# Altium schematic sheet ADC_CH_B.SchDoc
size A4; SheetNumber: 11; SheetTotal: 11
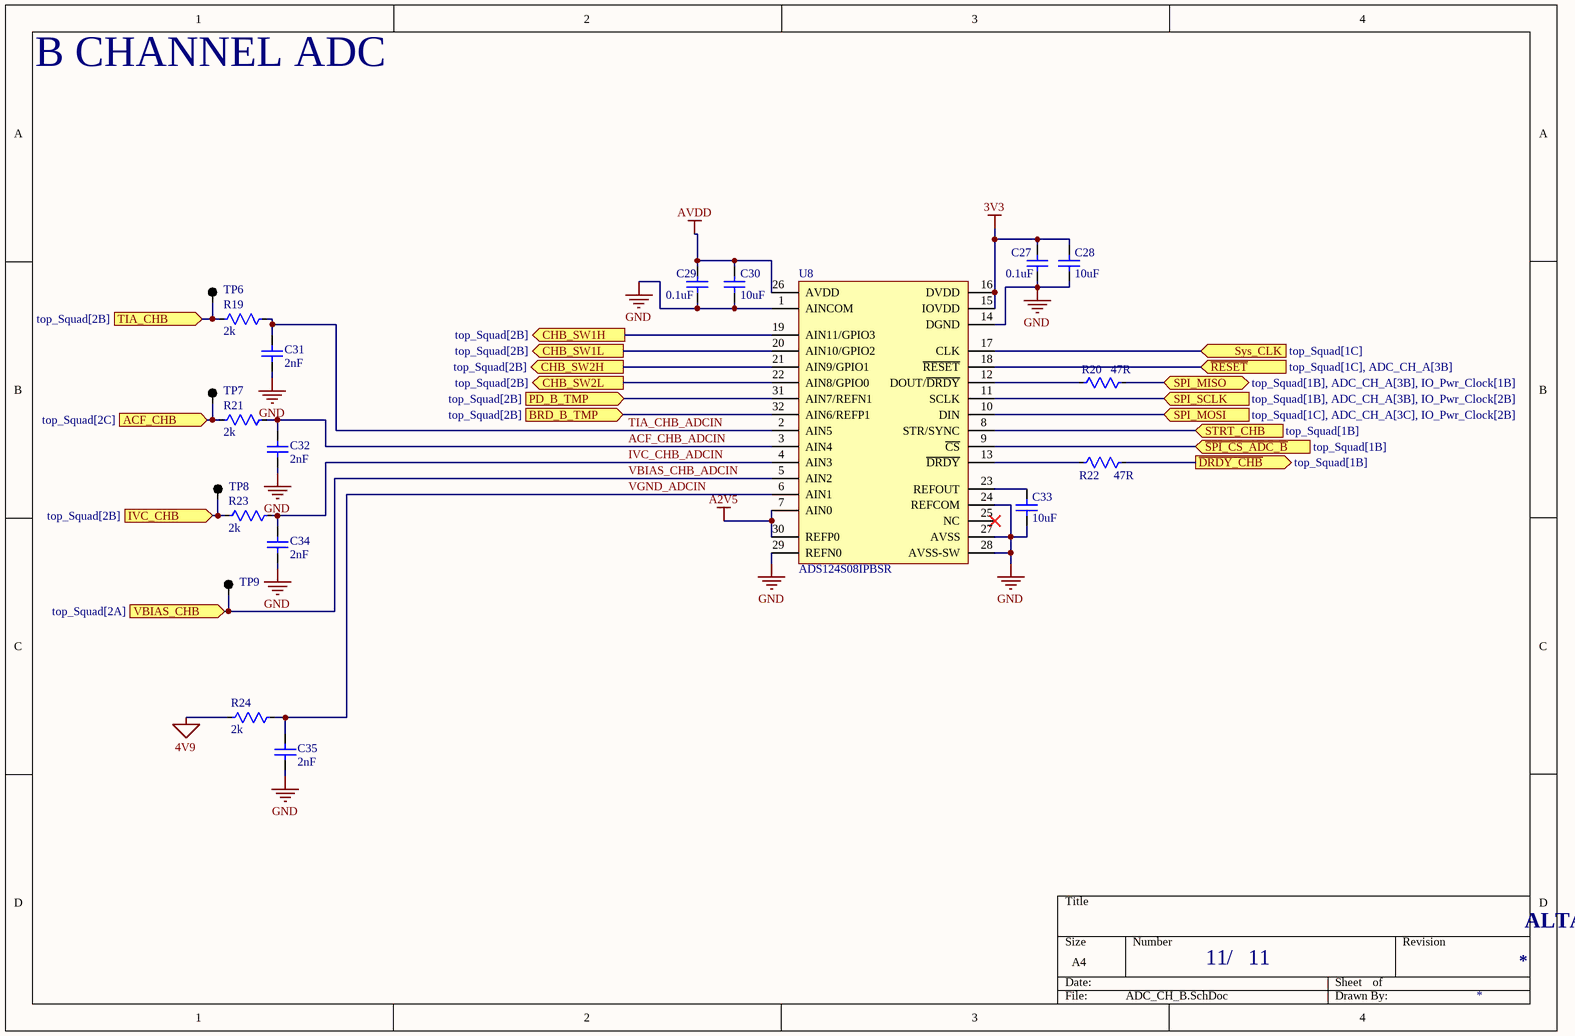
[diagram p0: ADC_CH_B.SchDoc]

## Parts
C27  0.1uF  [CAP 0603 IPC MID DENSITY]
C28  10uF  [CAP 0805 IPC MID DENSITY]
C29  0.1uF  [CAP 0603 IPC MID DENSITY]
C30  10uF  [CAP 0805 IPC MID DENSITY]
C31  2nF  [CAP 0603 IPC MID DENSITY]
C32  2nF  [CAP 0603 IPC MID DENSITY]
C33  10uF  [CAP 0805 IPC MID DENSITY]
C34  2nF  [CAP 0603 IPC MID DENSITY]
C35  2nF  [CAP 0603 IPC MID DENSITY]
R19  2k  [RES 0603 IPC MID DENSITY]
R20  47R  [RES 0402 NON-IPC SEI]
R21  2k  [RES 0603 IPC MID DENSITY]
R22  47R  [RES 0402 NON-IPC SEI]
R23  2k  [RES 0603 IPC MID DENSITY]
R24  2k  [RES 0603 IPC MID DENSITY]
TP6  Testpoint  [TESTPOINT THT]  (value not drawn)  (no BOM)
TP7  Testpoint  [TESTPOINT THT]  (value not drawn)  (no BOM)
TP8  Testpoint  [TESTPOINT THT]  (value not drawn)  (no BOM)
TP9  Testpoint  [TESTPOINT THT]  (value not drawn)  (no BOM)
U8  ADS124S08IPBSR  [32TQFP 7X7MM IPC LOW DENSITY]

## Ports
ACF_CHB (in, see top_Squad[2C]), BRD_B_TMP (in, see top_Squad[2B]), CHB_SW1H (out, see top_Squad[2B]), CHB_SW1L (out, see top_Squad[2B]), CHB_SW2H (out, see top_Squad[2B]), CHB_SW2L (out, see top_Squad[2B]), IVC_CHB (in, see top_Squad[2B]), PD_B_TMP (in, see top_Squad[2B]), SPI_MISO (bidir, see top_Squad[1B], ADC_CH_A[3B], IO_Pwr_Clock[1B]), SPI_MOSI (in, see top_Squad[1C], ADC_CH_A[3C], IO_Pwr_Clock[2B]), SPI_SCLK (in, see top_Squad[1B], ADC_CH_A[3B], IO_Pwr_Clock[2B]), STRT_CHB (in, see top_Squad[1B]), Sys_CLK (in, see top_Squad[1C]), TIA_CHB (in, see top_Squad[2B]), VBIAS_CHB (in, see top_Squad[2A]), ~{DRDY_CHB} (out, see top_Squad[1B]), ~{RESET} (in, see top_Squad[1C], ADC_CH_A[3B]), ~{SPI_CS_ADC_B} (in, see top_Squad[1B])

## Nets
3V3: C27.2 C28.2 U8.15(IOVDD) U8.16(DVDD)
4V9: R24.1
A2V5: U8.7(AIN0) U8.30(REFP0)
AVDD: C29.2 C30.2 U8.26(AVDD)
GND: C27.1 C28.1 C29.1 C30.1 C31.1 C32.1 C33.1 C34.1 C35.1 U8.1(AINCOM) U8.14(DGND) U8.24(REFCOM) U8.27(AVSS) U8.28(AVSS-SW) U8.29(REFN0)
~{DRDY_CHB}: R22.2 ; port ~{DRDY_CHB}
~{RESET}: U8.18(~{RESET}) ; port ~{RESET}
~{SPI_CS_ADC_B}: U8.9(~{CS}) ; port ~{SPI_CS_ADC_B}
ACF_CHB: R21.1 TP7.1 ; port ACF_CHB
ACF_CHB_ADCIN: C32.2 R21.2 U8.3(AIN4)
BRD_B_TMP: U8.32(AIN6/REFP1) ; port BRD_B_TMP
CHB_SW1H: U8.19(AIN11/GPIO3) ; port CHB_SW1H
CHB_SW1L: U8.20(AIN10/GPIO2) ; port CHB_SW1L
CHB_SW2H: U8.21(AIN9/GPIO1) ; port CHB_SW2H
CHB_SW2L: U8.22(AIN8/GPIO0) ; port CHB_SW2L
IVC_CHB: R23.1 TP8.1 ; port IVC_CHB
IVC_CHB_ADCIN: C34.2 R23.2 U8.4(AIN3)
PD_B_TMP: U8.31(AIN7/REFN1) ; port PD_B_TMP
SPI_MISO: R20.2 ; port SPI_MISO
SPI_MOSI: U8.10(DIN) ; port SPI_MOSI
SPI_SCLK: U8.11(SCLK) ; port SPI_SCLK
STRT_CHB: U8.8(STR/SYNC) ; port STRT_CHB
Sys_CLK: U8.17(CLK) ; port Sys_CLK
TIA_CHB: R19.1 TP6.1 ; port TIA_CHB
TIA_CHB_ADCIN: C31.2 R19.2 U8.2(AIN5)
VBIAS_CHB_ADCIN: TP9.1 U8.5(AIN2) ; port VBIAS_CHB
VGND_ADCIN: C35.2 R24.2 U8.6(AIN1)
NetC33_2: C33.2 U8.23(REFOUT)
NetR20_1: R20.1 U8.12(DOUT/~{DRDY})
NetR22_1: R22.1 U8.13(~{DRDY})

Not connected (* = marked no-connect by the designer): U8 25(NC)*

## Notes on the sheet
- B CHANNEL ADC
- /
- ALTAIR PhotoDiode ReadOut (PDRO) - Squad

## Library data of the parts
C27 C29 = CAP: Kemet C0603C104K5RACAUTO - Cap Ceramic 0.1uF 50V X7R 10% 0603 125C Paper T/R; MF: Kemet; MP: C0603C104K5RACAUTO
C28 C30 C33 = CAP: Murata GRM21BR61E106KA73L - Cap Ceramic 10uF 10% 25V X5R 0805; MF: Murata; MP: GRM21BR61E106KA73L
C31 C32 C34 C35 = CAP: Murata GCM1885C1H202FA16J 50V 2nF C0G ±1% 0603; MF: Murata; MP: GCM1885C1H202FA16J
R19 R21 R23 R24 = RES: Panasonic ERJ-3EKF2001V Res Thick Film 0603 2K Ohm 1% 1/10W ±100ppm/°C; MF: Panasonic Electronic Components; MP: ERJ-3EKF2001V
R20 R22 = RES: Stackpole RMCF0402JT47R0 - Res 47Ohm 5% 0.063W 0402 Thick Film AEC-Q200 compliant; MF: Stackpole Electronics Inc.; MP: RMCF0402JT47R0
U8 = ADS124S08IPBSR: 24BIT ADC Delta-Sigma 4k samples/s PGA V-reference; Interface: SPI; Number of Inputs: 12; Number of Bits: 24; Sampling Rate: 4000S/s; Number of A/D Converters: 1; MF: Texas Instruments; RoHS: No; Category: Analog to Digital Converters (ADCs); Stock 1: 2523; Mount: Surface Mount; Case/Package: LQFP; Number of Pins: 32; Min Operating Temperature: -50°C; Max Operating Temperature: 125°C; Packaging: Tape and Reel; ComponentLink1URL: http://www.ti.com/general/docs/lit/getliterature.tsp?genericPartNumber=ADS124S08&fileType=pdf&src-supplier=Farnell; ComponentLink1Description: http://www.ti.com/general/docs/lit/getliterature.tsp?genericPartNumber=ADS124S08&fileType=pdf&src-supplier=Farnell; ComponentLink2URL: http://www.ti.com/lit/ds/symlink/ads124s06.pdf?src-supplier=Digi-Key; ComponentLink2Description: http://www.ti.com/lit/ds/symlink/ads124s06.pdf?src-supplier=Digi-Key; Supplier 1: Digi-Key; Supplier Part Number 1: 296-45170-1-ND; MP: ADS124S08IPBSR